# EAGLE design BUB-III-r1 (EAGLE 7.3.0)
ABBREV: UF1; PROJECT: USB FTDI
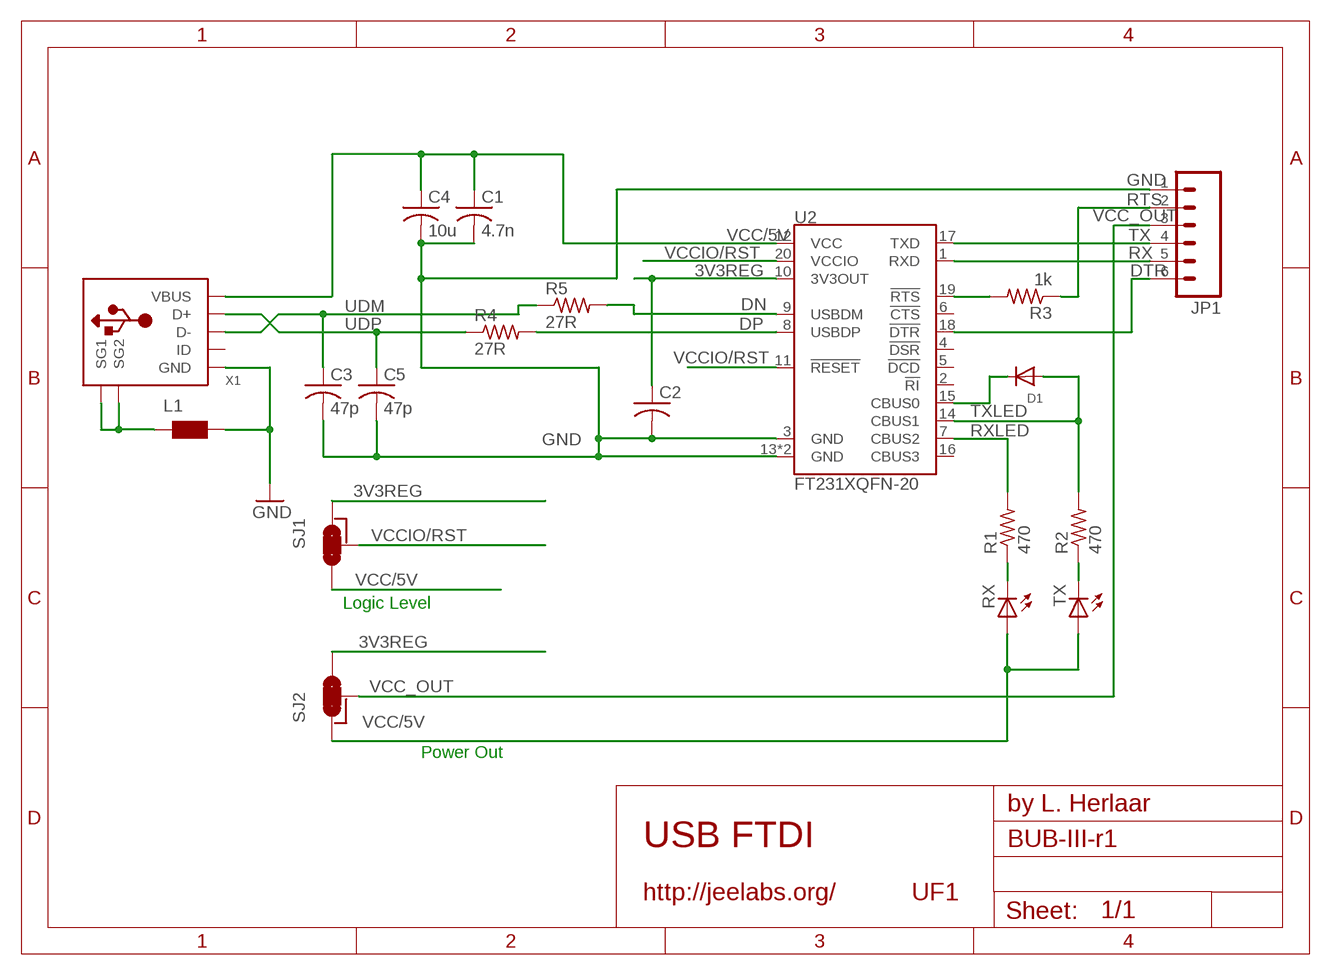
[diagram p0: schematic, sheet 1]

## Parts
C1  4.7n  C-USC0603K  [C0603K]
C2  C-USC0603K  [C0603K]
C3  47p  C-USC0603K  [C0603K]
C4  10u  C-USC0805K  [C0805K]
C5  47p  C-USC0603K  [C0603K]
D1  DIODE_SOD-323  [SOD-323]
JP1  M06SMD-FEMALE-V2  [1X06-SMD-FEMALE-V2]
L1  FERRITE_BEAD_0603  [WUERTH-ELEKTRONIK_0603]
R1  470  R-US_R0603  [R0603]
R2  470  R-US_R0603  [R0603]
R3  1k  R-US_R0603  [R0603]
R4  27R  R-US_R0603  [R0603]
R5  27R  R-US_R0603  [R0603]
RX  LEDCHIP-LED0805  [CHIP-LED0805]
SJ1  SOLDERJUMP_SPDTSHORT_PASTE  [SJ-SHRTINPASTE]
SJ2  SOLDERJUMP_SPDTSHORT_PASTE  [SJ-SHRTINPASTE]
TX  LEDCHIP-LED0805  [CHIP-LED0805]
U2  FT231XQFN-20  [QFN-20]
X1  USB  [USB-AB-MICRO-SMD]

## Nets
3V3REG: C2.1 SJ1.1 SJ2.3 U2.10(3V3OUT)
DN: R5.2 U2.9(USBDM)
DP: R4.2 U2.8(USBDP)
DTR: JP1.6 U2.18(!DTR)
GND [power]: C1.2 C2.2 C3.2 C4.2 C5.2 JP1.1 L1.2 U2.3(GND) U2.13(GND) U2.P(GND) X1.GND
N$1: D1.C U2.15(CBUS0)
N$2: R1.1 RX.C
N$5: R2.1 TX.C
N$9: R3.2 U2.19(!RTS)
RTS: JP1.2 R3.1
RX: JP1.5 U2.1(RXD)
RXLED: R1.2 U2.7(CBUS2)
TX: JP1.4 U2.17(TXD)
TXLED: D1.A R2.2 U2.14(CBUS1)
UDM: C3.1 R5.1 X1.D-
UDP: C5.1 R4.1 X1.D+
USB_CASE [power]: L1.1 X1.P$1(SG1) X1.P$2(SG2) X1.P$3(SG1) X1.P$4(SG2)
VCC/5V [power]: C1.1 C4.1 RX.A SJ1.3 SJ2.1 TX.A U2.12(VCC) X1.VBUS
VCC_OUT: JP1.3 SJ2.2
VCCIO/RST: SJ1.2 U2.11(!RESET) U2.20(VCCIO)
Unconnected: U2.2(!RI) U2.4(!DSR) U2.5(!DCD) U2.6(!CTS) U2.16(CBUS3) X1.ID

## Notes on the sheet
- Logic Level
- Power Out

## Library data of the parts
C1-C5 = ModernDevice:C-US: CAPACITOR, American symbol
D1 = ModernDevice:DIODE: Diode SMADIODE - SMA Surface Mount Package 20V 1A Schottky Diode Digikey: 641-1014-6-ND DO-1N4148 - Through Hole Small Current Diode SOD-123 20V 1 A (.5mV Vf) Schottky Diode - Digikey: MBRX120TPMSCT-ND 4148 diode 75V 1N4148WTPMSCT-ND 1N4148W-TP - Micro Commercial Co 1N4148WTPMSCT-ND This part is RoHS compliant. SOD-323 10V 570mA (.38mV Vf, 3ns) Schottky Diode - Digikey: ZLLS410CT-ND SOD-523 30V 30mA Schottky Diode (RB751S-40TE61) - Digikey: RB751S-40TE61CT-ND 75V 150mA 4148 type - Digikey: 1N4148XTPMSCT-ND SOT23-R/W - SOT23 Package (R = Solder Paste/Reflow Ovens, W = Hand-Soldering) BAT54Film 40V 300mA - Digikey: 497-7162-1-ND DO-214AC DO-214AC 400V 1A Fast Recovery - Digikey: RS1GFSCT-ND MELF-34 4148 style diode - Digikey:FDLL4148CT-ND
JP1 = ModernDevice:M06: Header 6 Standard 6-pin 0.1" header. Use with straight break away headers (SKU : PRT-00116), right angle break away headers (PRT-00553), swiss pins (PRT-00743), machine pins (PRT-00117), and female headers (PRT-00115). Molex polarized connector foot print use with SKU : PRT-08094 with associated crimp pins and housings. NOTES ON THE VARIANTS LOCK and LOCK_LONGPADS... This footprint was designed to help hold the alignment of a through-hole component (i.e. 6-pin header) while soldering it into place. You may notice that each hole has been shifted either up or down by 0.005 of an inch from it's more standard position (which is a perfectly straight line). This slight alteration caused the pins (the squares in the middle) to touch the edges of the holes. Because they are alternating, it causes a "brace" to hold the component in place. 0.005 has proven to be the perfect amount of "off-center" position when using our standard breakaway headers. Although looks a little odd when you look at the bare footprint, once you have a header in there, the alteration is very hard to notice. Also, if you push a header all the way into place, it is covered up entirely on the bottom side. This idea of altering the position of holes to aid alignment will be further integrated into the Sparkfun Library for other footprints. It can help hold any component with 3 or more connection pins.
L1 = ModernDevice:FERRITE_BEAD: SMD EMI Suppression Ferrite Beads - excellent anti-EMI properties - low DCR - impedances till 3000 ohms - rated current up to 6 A These pads are small for some reason - L0603 has std resistor sized pads 240-2365-1-ND is a Digikey part with 300 ohms at 100Mhz
R1-R5 = ModernDevice:R-US_: RESISTOR, American symbol
RX TX = led:LED: LED OSRAM: - CHIPLED LG R971, LG N971, LY N971, LG Q971, LY Q971, LO R971, LY R971 LH N974, LH R974 LS Q976, LO Q976, LY Q976 LO Q996 - Hyper CHIPLED LW Q18S LB Q993, LB Q99A, LB R99A - SideLED LS A670, LO A670, LY A670, LG A670, LP A670 LB A673, LV A673, LT A673, LW A673 LH A674 LY A675 LS A676, LA A676, LO A676, LY A676, LW A676 LS A679, LY A679, LG A679 - Hyper Micro SIDELED® LS Y876, LA Y876, LO Y876, LY Y876 LT Y87S - SmartLED LW L88C, LW L88S LB L89C, LB L89S, LG L890 LS L89K, LO L89K, LY L89K LS L896, LA L896, LO L896, LY L896 - TOPLED LS T670, LO T670, LY T670, LG T670, LP T670 LSG T670, LSP T670, LSY T670, LOP T670, LYG T670 LG T671, LOG T671, LSG T671 LB T673, LV T673, LT T673, LW T673 LH T674 LS T676, LA T676, LO T676, LY T676, LB T676, LH T676, LSB T676, LW T676 LB T67C, LV T67C, LT T67C, LS T67K, LO T67K, LY T67K, LW E67C LS E67B, LA E67B, LO E67B, LY E67B, LB E67C, LV E67C, LT E67C LW T67C LS T679, LY T679, LG T679 LS T770, LO T770, LY T770, LG T770, LP T770 LB T773, LV T773, LT T773, LW T773 LH T774 LS E675, LA E675, LY E675, LS T675 LS T776, LA T776, LO T776, LY T776, LB T776 LHGB T686 LT T68C, LB T68C - Hyper Mini TOPLED® LB M676 - Mini TOPLED Santana® LG M470 LS M47K, LO M47K, LY M47K Source: http://www.osram.convergy.de LUXEON: - LUMILED® LXK2-PW12-R00, LXK2-PW12-S00, LXK2-PW14-U00, LXK2-PW14-V00 LXK2-PM12-R00, LXK2-PM12-S00, LXK2-PM14-U00 LXK2-PE12-Q00, LXK2-PE12-R00, LXK2-PE12-S00, LXK2-PE14-T00, LXK2-PE14-U00 LXK2-PB12-K00, LXK2-PB12-L00, LXK2-PB12-M00, LXK2-PB14-N00, LXK2-PB14-P00, LXK2-PB14-Q00 LXK2-PR12-L00, LXK2-PR12-M00, LXK2-PR14-Q00, LXK2-PR14-R00 LXK2-PD12-Q00, LXK2-PD12-R00, LXK2-PD12-S00 LXK2-PH12-R00, LXK2-PH12-S00 LXK2-PL12-P00, LXK2-PL12-Q00, LXK2-PL12-R00 Source: www.luxeon.com KINGBRIGHT: KA-3528ASYC Source: www.kingbright.com
SJ1 SJ2 = ModernDevice:SOLDERJUMP_SPDT: Solder Jumper Standard SMD solder jumper. Used to automate production. Two varients : Normally Open and Normally Closed are the same, but have different paste layers. NC will have a large amount of paste and should jumper during reflow.
U2 = ModernDevice:FT231X: FTDI FT231X Full Speed USB to Full-handshake UART This USB2.0 Full Speed IC offers a compact bridge to full handshake UART interfaces. The device is a UART, capable of operating up to 3MBaud, with low power consumption (8mA). The FT231X includes the complete FT-X series feature set and enables USB to be added into a system design quickly and easily over a UART interface.
X1 = ModernDevice:USB: USB Connectors USBMINIB - Surface Mount Female Mini-B USB Connector 4UConnector: 06564 By microbuilder.eu Thru-hole RA Female Mini-B USB Connector 4UConnector: 18732 USB-MICRO 4 TAB MODEL 609-4618-1-ND

## Net classes
0 default: drill 0.178 mm, clearance 0.178 mm
1 power: width 0.381 mm, clearance 0.178 mm

## Board
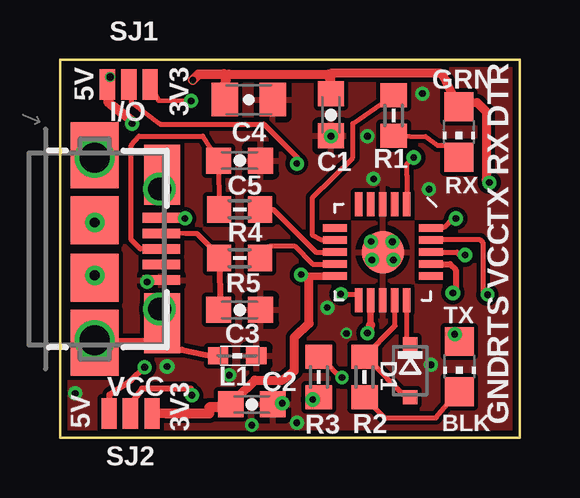
[diagram p1: board, top side]
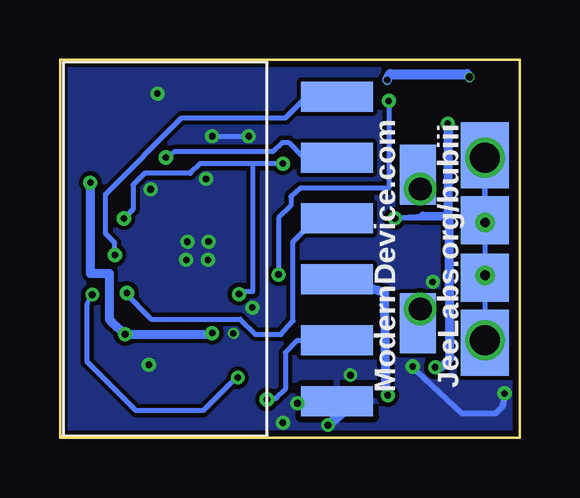
[diagram p2: board, bottom side, seen from below]

Size 19.18 x 15.75 mm. Coordinates in mm from the lower left corner, seen from the top.
Outline: 0,0 19.18,0 19.18,15.75 0,15.75 0,0
Copper layers (1*16): Top 0.035mm / dielectric 1.5mm / Bottom 0.035mm
Design rules "gardena-final *": minimum track width 8mil, minimum drill 12mil, track to track 7mil, track to pad 7mil, pad to pad 7mil, via to via 7mil, smd to smd 7mil, copper to edge 10mil, drill to drill 8mil, minimum pad ring 8mil, minimum via ring 0mil, stop-mask expansion 2.5mil, vias tented up to drill 26mil, thermal gap 10mil

### Footprints (pad centres in the part's own frame; a part is rotated, then mirrored left to right if it is on the bottom)
C0603K = smd 1.05 x 1.08: 1 -0.875,0; 2 0.875,0
C0805K = smd 1.1 x 1.4: 1 -1,0; 2 1,0
SOD-323 = smd 0.6 x 0.6: A 1.1,0; C -1.1,0
1X06-SMD-FEMALE-V2 = smd 1.25 x 3: 1 6.35,-0.004; 2 3.81,-0.004; 3 1.27,-0.004; 4 -1.27,-0.004; 5 -3.81,-0.004; 6 -6.35,-0.004
WUERTH-ELEKTRONIK_0603 = smd 0.85 x 0.7: 1 -0.9,0; 2 0.7,0
R0603 = smd 1 x 1.1: 1 -0.85,0; 2 0.85,0
CHIP-LED0805 = smd 1.2 x 1.2: A 0,-1.05; C 0,1.05
SJ-SHRTINPASTE = smd 0.635 x 1.27: 1 -0.894,0; 2 -0.005,0; 3 0.894,0
QFN-20 = smd 1 x 0.3: 1 -2,1; 2 -2,0.5; 3 -2,0; 4 -2,-0.5; 5 -2,-1; 11 2,-1; 12 2,-0.5; 13 2,0; 14 2,0.5; 15 2,1 | smd 0.3 x 1: 6 -1,-2; 7 -0.5,-2; 8 0,-2; 9 0.5,-2; 10 1,-2; 16 1,2; 17 0.5,2; 18 0,2; 19 -0.5,2; 20 -1,2 | smd 1.778 x 1.778: P 0,0
USB-AB-MICRO-SMD = smd 2 x 2.75: CASE1 0,-3.9; CASE7 0,3.9 | smd 2 x 2: CASE3 0,-1.2; CASE5 0,1.2 | smd 2 x 2 bottom: CASE4 0,-1.2; CASE6 0,1.2 | smd 2 x 2.75 bottom: CASE8 0,3.9; CASE11 0,-3.9 | smd 1.5 x 2.5: CASE9 2.8,-3.1; CASE10 2.8,3.1 | smd 1.5 x 2.5 bottom: CASE12 2.8,-3.1; CASE13 2.8,3.1 | smd 1.55 x 0.4: D+ 2.775,0; D- 2.775,0.65; GND 2.775,-1.3; ID 2.775,-0.65; VBUS 2.775,1.3 | drill 1.25 pad 0.305: P$1 0,-3.8; P$4 0,3.8 | drill 0.406 pad 0.305: P$2 0,-1.1; P$3 0,1.1 | drill 0.95 pad 0.61: P$6 2.7,2.5; P$7 2.7,-2.5

### Placement (x,y rotation side)
C1  11.3,13.46 270 top
C2  8,1.4 0 top
C3  7.49,5.33 0 top
C4  7.87,14.1 0 top
C5  7.49,11.56 0 top
D1  14.61,2.79 270 top
JP1  7.62,7.87 270 bottom
L1  7.49,3.43 0 top
R1  13.92,13.44 90 top
R2  12.7,2.54 90 top
R3  10.79,2.54 90 top
R4  7.49,9.53 0 top
R5  7.49,7.49 0 top
RX  16.64,12.75 180 top
SJ1  2.87,14.73 180 top
SJ2  2.95,1.02 0 top
TX  16.66,2.97 180 top
U2  13.46,7.75 270 top
X1  1.45,7.87 0 top

### Tracks (layer width: path | path; a pad name or v marks a point on that pad's centre or on a via)
3V3REG  (via drill 0.28 pad 0.58)
  Top 0.203: 10.39,6.68 9.92,6.74 v10.06,6.81 | 11.57,6.74 U2.10 | 6.9,1.27 C2.1 7.37,1.65 | SJ1.1 4.11,14.07 v5.47,14.04
  Top 0.305: 9.92,6.74 11.57,6.74
  Top 0.381: 10.39,6.68 10.39,4.78 9.78,4.19 9.78,2.79 9.27,2.41 8.13,2.41 7.37,1.65
  Top 0.406: 6.9,1.27 6.22,1.27 6.22,1.02 4.43,1.02 SJ2.3
  Bottom 0.203: v5.47,14.04 5.46,12.45 5.46,10.41 9.14,10.41 9.55,10.06 9.55,9.68 10.06,9.17 v10.06,6.81
DN
  Top 0.203: R5.2 8.02,7.25 8.76,8 9.78,8 10.54,7.24 11.55,7.24 U2.9
DP
  Top 0.203: R4.2 8.89,9.53 10.67,7.75 U2.8
DTR  (via drill 0.28 pad 0.61)
  Top 0.203: U2.18 16.56,7.75 16.68,7.62 v16.89,7.62
  Bottom 0.203: v16.89,7.62 16.89,8.13 17.27,8.51 17.27,10.16 14.1,13.34 9.78,13.34 8.89,14.22 JP1.6
GND  (via drill 0.28 pad 0.46, 0.28 pad 0.56, 0.28 pad 0.58, 0.28 pad 0.61)
  Top 0.254: 13.71,7.5 U2.P | X1.GND 3.96,6.57 3.83,6.45 | 3.81,6.6 3.83,6.45 | 3.83,6.45 v3.63,6.5
  Bottom 0.203: v12.83,12.57 11.34,12.57 11.3,12.61
  Bottom 0.254: 0.71,1.42 v0.64,1.85 0.71,1.32 1.02,1.02 2.39,1.02 4.32,2.79 4.47,2.95 v4.47,2.97
  Bottom 0.406: JP1.1 6.88,1.52 v8,0.53
  other vias: 15.47,3.05 15.11,14.35 13.08,10.79 9.88,0.64 12.98,8.18 13.86,8.18 13.01,7.42 11.3,12.57 15.39,10.36 11.15,5.43 11.94,4.36 9.27,1.45 13.91,7.42 7.06,2.62
  pour Bottom (rank 6): -2.54,-2.54 -2.54,18.41 21.59,18.41 21.59,-2.54
  pour Top: -1.27,17.02 20.32,17.14 20.32,-1.14 -1.27,-1.27
N$1
  Top 0.203: D1.C 14.58,3.91 14.48,4.01 14.48,5.84 U2.15
N$2
  Top 0.203: R1.1 15.26,12.56 15.75,12.19 16.6,12.19 RX.C
N$5
  Top 0.203: R2.1 13.52,0.84 15.69,0.84 16.26,1.52 16.51,1.52 16.76,1.78 16.67,1.78 TX.C
N$9  (via drill 0.28 pad 0.56)
  Top 0.203: U2.19 15.37,8.26 17.53,8.26 17.65,8.13 17.65,6.1 17.78,5.97 v17.83,5.97 | v11.76,2.52 11.53,2.69 10.83,3.43 R3.2
  Bottom 0.203: v11.76,2.52 12.06,2.29 13.21,1.14 16,1.14 18.03,3.17 18.03,5.59 v17.83,5.97
RTS  (via drill 0.28 pad 0.61)
  Top 0.203: 10.76,1.56 R3.1 10.76,1.65 v10.54,1.6
  Bottom 0.203: v10.54,1.6 10.16,1.65 9.78,2.03 9.78,3.56 9.27,4.06 JP1.2
RX  (via drill 0.28 pad 0.61)
  Top 0.203: U2.1 14.48,10.43 14.47,10.92 14.47,11.43 v14.75,11.68
  Bottom 0.203: v14.75,11.68 14.38,11.94 10.29,11.94 9.91,12.32 9.65,12.32 9.02,11.68 JP1.5
RXLED
  Top 0.203: U2.7 10.93,8.25 10.54,8.44 10.54,10.03 12.22,11.68 12.22,13.1 R1.2
TX  (via drill 0.28 pad 0.61)
  Top 0.203: 15.88,7.24 15.37,7.24 U2.17
  Top 0.254: 15.88,7.24 16.26,7.24 16.5,7 16.5,6.23 v16.38,6.04
  Bottom 0.203: v16.38,6.04 16.51,6.1 15.37,4.95 11.66,4.95 11.03,4.32 9.96,4.32 9.45,4.88 9.45,8.18 8.48,9.14 JP1.4
TXLED
  Top 0.203: U2.14 13.97,5.58 13.97,4.67 R2.2 12.94,3.19 14.33,1.8 14.54,1.8 D1.A
UDM
  Top 0.203: R5.1 6.59,7.63 5.71,8.51 5.25,8.51 X1.D-
  Top 0.254: R5.1 6.69,5.41 C3.1
UDP
  Top 0.203: R4.1 C5.1 5.95,12.57 3.3,12.57 2.97,12.19 2.97,8.26 3.35,7.87 X1.D+
USB_CASE
  Top 0.203: X1.P$1 4.11,4.07
  Top 0.254: L1.1 6.52,3.4 6.48,3.38 5.08,3.68 3.68,3.68 3.87,3.87 4.11,4.14 4.11,4.07
  Bottom 0.203: 1.5,11.3 X1.P$3 | X1.P$4 X1.P$3 | X1.P$3 X1.P$2 X1.P$1
  pour Bottom (isolate 0.102, no thermals): 2.41,2.79 2.41,12.95 0,12.95 0.13,2.79
VCC/5V  (via drill 0.28, 0.28 pad 0.58, 0.3 pad 0.41)
  Top 0.203: 16.48,3.92 v16.46,4.32 | 12.95,5.72 U2.12 | 5.19,9.15 v5.21,9.15 5.15,9.2 X1.VBUS | C4.1 7.1,15.23 7.04,15.16 | 11.28,14.68 11.25,14.36 | 6.9,15.1 6.83,15.16 | RX.A 16.48,14 | 17.78,10.74 v17.91,10.64
  Top 0.254: 2.95,13.13 v3.01,13.1 | SJ2.1 2.06,1.81 2.97,2.41 v3.53,2.95
  Top 0.279: 12.95,4.7 12.95,5.72
  Top 0.381: RX.A 16.09,14.89 15.88,15.19 11.29,15.19 C1.1 11.25,14.36 | TX.A 16.48,3.92 | v12.83,4.37 12.9,4.37 12.95,4.7 | 7.04,15.16 11.2,15.16 11.28,14.68 | C4.1 6.9,15.1 | v2.1,15.04 2.11,14.45 | 16.48,14 17.4,13.97 17.78,13.59 17.78,10.74
  Top 0.4: SJ1.3 1.98,14.22 2.03,14.17 2.02,13.98 2.95,13.26 2.95,13.13
  Top 0.406: 6.83,15.16 5.77,15.14 v5.54,14.91 | SJ1.3 1.98,14.91 v2.1,15.04
  Bottom 0.203: 4.04,9.25 v5.21,9.15 3.91,9.17 2.97,9.2
  Bottom 0.254: 2.97,13.06 v3.01,13.1
  Bottom 0.381: v12.83,4.37 12.93,4.32 v16.46,4.32 17.02,4.83 17.12,4.95 17.12,6.86 17.91,6.86 v17.91,10.64 | v3.53,2.95 3.28,2.95 2.92,3.3 2.95,9.22 4.04,9.25 | 2.97,9.2 2.97,12.57
  Bottom 0.4: 2.97,12.57 2.97,13.06
  Bottom 0.406: v5.54,14.91 5.41,15.16 2.21,15.16 2.1,15.03 v2.1,15.03 | v2.1,15.03 v2.1,15.04 | v2.1,15.03 v2.1,15.04
VCC_OUT  (via drill 0.28 pad 0.58)
  Top 0.1: SJ2.2 2.92,0.89 2.93,0.89
  Top 0.254: v5.51,1.78 5.46,2.06 3.43,2.06 2.91,1.34 2.93,0.89 2.91,0.83
  Bottom 0.203: 6.17,6.22 JP1.3
  Bottom 0.381: v5.51,1.78 5.51,1.95 5.59,2.03 5.63,6.04 6.17,6.22
VCCIO/RST  (via drill 0.28 pad 0.58)
  Top 0.203: v16.51,9.14 16.38,9.14 16,8.76 15.38,8.76 U2.20 | v9.88,11.43 9.91,11.68 8.51,13.08 4.18,13.08 2.97,13.99 2.96,14.23 SJ1.2 | v11.71,5.99 12.45,5.99 U2.11
  Bottom 0.203: v9.88,11.43 11.12,11.43 | 11.12,11.43 13.34,11.43 13.74,11.02 15.65,11.02 16.13,10.54 16.13,9.53 v16.51,9.14 | 11.12,11.43 11.12,6.1 11.58,6.1 v11.71,5.99

### Text on the board
_tsilk: GRN | 5V | I/O | 3V3 | DTR | RX | RX | TX | VCC | TX | RTS | VCC | GND | 5V | 3V3 | BLK
_bsilk: JeeLabs.org/bubiii | ModernDevice.com